# EAGLE design TempStanchion.v3 (EAGLE 7.5.0)
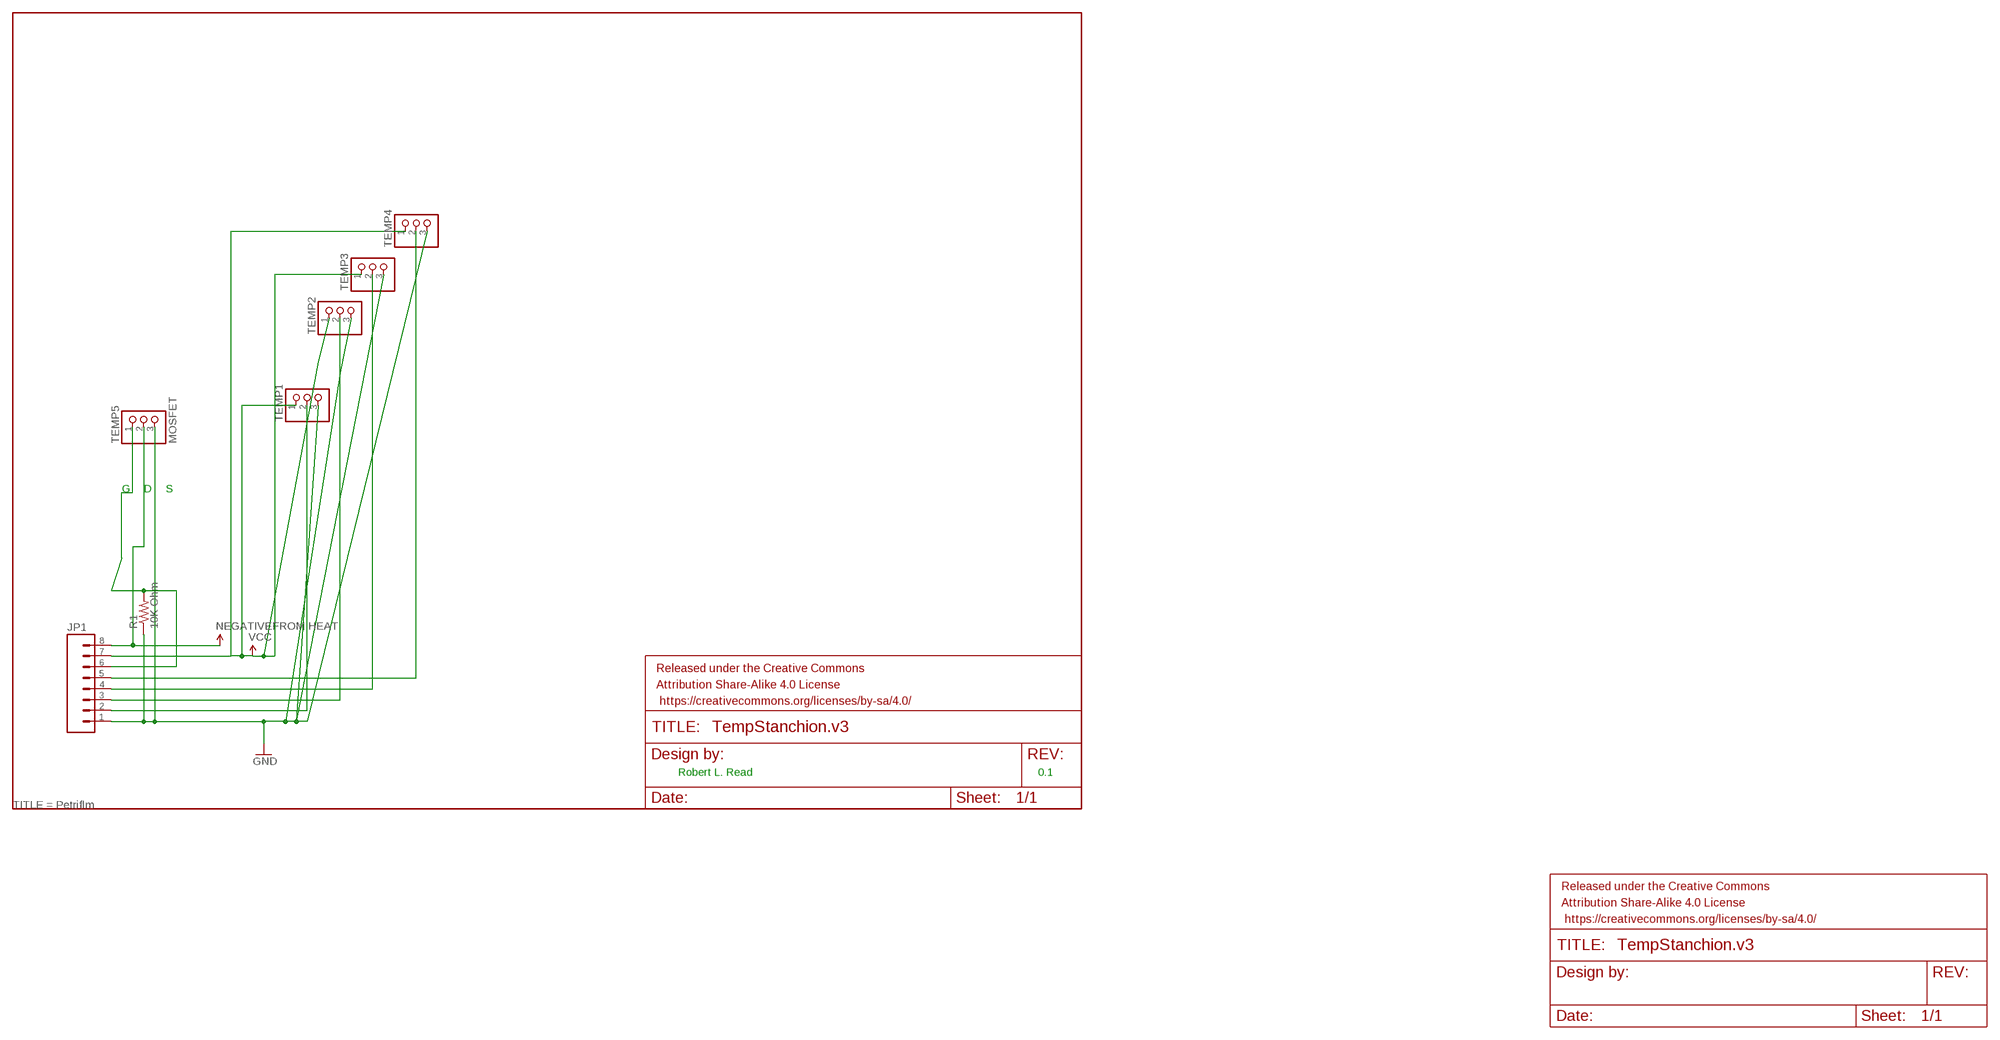
[diagram p0: schematic, sheet 1]

## Parts
FRAME1  FRAME-LETTER  [CREATIVE_COMMONS]
FRAME2  FRAME-LETTER  [CREATIVE_COMMONS]
JP1  M08  [1X08_ROUND]
R1  10K Ohm  RESISTORPTH-1W  [AXIAL-0.6]
TEMP1  PINHD-1X3  [1X03]
TEMP2  PINHD-1X3  [1X03]
TEMP3  PINHD-1X3  [1X03]
TEMP4  PINHD-1X3  [1X03]
TEMP5  MOSFET  PINHD-1X3  [1X03]

## Nets
GND: JP1.1 R1.P$1 TEMP1.3 TEMP2.3 TEMP3.3 TEMP4.3 TEMP5.3
MOSFET: JP1.6 R1.P$2 TEMP5.1
N$2: JP1.2 TEMP1.2
N$3: JP1.3 TEMP2.2
N$4: JP1.4 TEMP3.2
N$5: JP1.5 TEMP4.2
VCC: JP1.7 JP1.8 TEMP1.1 TEMP2.1 TEMP3.1 TEMP4.1 TEMP5.2 ; supply symbol labelled NEGATIVEFROM HEAT

## Notes on the sheet
- G | D | S
- Robert L. Read | 0.1

## Library data of the parts
FRAME1 = SparkFun-Aesthetics:FRAME-LETTER: Schematic Frame Standard 8.5x11 US Letter frame
FRAME2 = SparkFun-Aesthetics:FRAME-LETTER: Schematic Frame Standard 8.5x11 US Letter frame; TITLE: Petriflm
JP1 = SparkFun-Connectors:M08: Header 8 Standard 8-pin 0.1" header. Use with straight break away headers (SKU : PRT-00116), right angle break away headers (PRT-00553), swiss pins (PRT-00743), machine pins (PRT-00117), and female headers (PRT-00115).
R1 = SparkFun-Resistors:RESISTOR: Resistor Basic schematic elements and footprints for 0603, 1206, and PTH resistors.
TEMP1-TEMP5 = adafruit:PINHD-1X3: PIN HEADER

## Net classes
0 default: width 0.305 mm, drill 0.508 mm, clearance 0.381 mm
1 Power: width 0.508 mm, drill 0.508 mm, clearance 0.381 mm

## Board
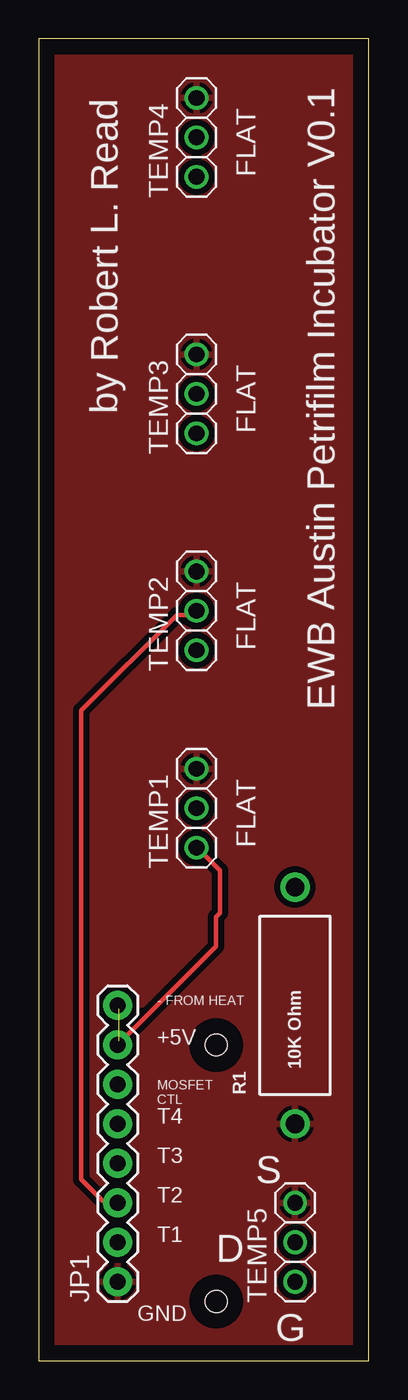
[diagram p1: board, top side]
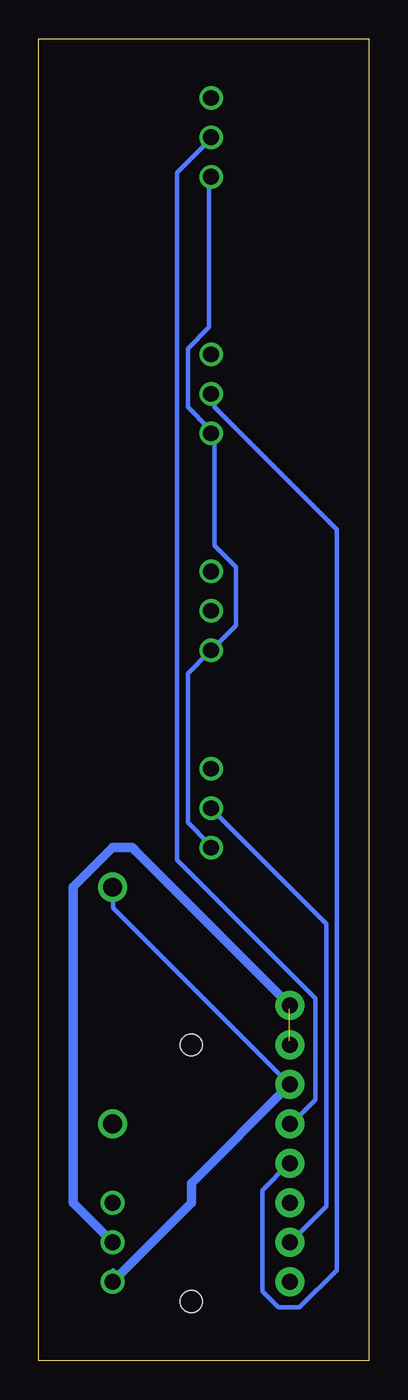
[diagram p2: board, bottom side, seen from below]

Size 21.26 x 85.08 mm. Coordinates in mm from the lower left corner, seen from the top.
Outline: 0,0 21.26,0 21.26,85.08 0,85.08 0,0
Copper layers (1*16): Top 0.035mm / dielectric 1.5mm / Bottom 0.035mm
Design rules "default": minimum track width 10mil, minimum drill 24mil, track to track 8mil, track to pad 8mil, pad to pad 8mil, via to via 8mil, smd to smd 8mil, copper to edge 40mil, drill to drill 8mil, minimum pad ring 10mil, minimum via ring 8mil, stop-mask expansion 4mil, vias tented up to drill 0mil, thermal gap 10mil
Holes 1.4 mm at 11.43,3.81 11.43,20.32

### Footprints (pad centres in the part's own frame; a part is rotated, then mirrored left to right if it is on the bottom)
1X08_ROUND = drill 1.016 pad 1.88: 1 0,0; 2 2.54,0; 3 5.08,0; 4 7.62,0; 5 10.16,0; 6 12.7,0; 7 15.24,0; 8 17.78,0
AXIAL-0.6 = drill 1.2 pad 1.88: P$1 -7.62,0; P$2 7.62,0
1X03 = drill 1.016: 1 -2.54,0; 2 0,0; 3 2.54,0

### Placement (x,y rotation side)
FRAME1  10.16,-31.75 0 top  (outside the outline)
FRAME2  10.16,-40.64 0 top  (outside the outline)
JP1  5.08,5.08 90 top
R1  16.51,22.86 90 top
TEMP1  10.16,35.56 90 top
TEMP2  10.16,48.26 90 top
TEMP3  10.16,62.23 90 top
TEMP4  10.16,78.74 90 top
TEMP5  16.51,7.62 90 top

### Tracks (layer width: path | path; a pad name or v marks a point on that pad's centre or on a via)
GND
  pour Top: 0,86.36 0,-1.27 22.86,-1.27 22.86,86.36
MOSFET
  Bottom 0.305: 16.46,5.83 16.46,5.14 TEMP5.1 | R1.P$2 16.46,30.18 16.46,29.15 5.14,17.83 JP1.6
  Bottom 0.61: 5.14,17.83 5.14,17.72 11.43,11.43 11.43,10.16 TEMP5.1
N$2
  Bottom 0.305: TEMP1.2 9.94,35.32 2.74,28.12 2.74,9.94 4.8,7.89 JP1.2
N$3
  Top 0.305: TEMP2.2 9.94,48.01 8.91,48.01 2.74,41.83 2.74,11.66 4.12,10.29 4.8,10.29 JP1.3
N$4
  Bottom 0.305: TEMP3.2 9.94,62.06 9.94,61.38 2.06,53.49 2.06,5.83 4.46,3.43 5.83,3.43 6.86,4.46 6.86,10.97 5.14,12.69 JP1.4
N$5
  Bottom 0.305: TEMP4.2 10.29,78.52 12.34,76.47 12.34,32.23 3.43,23.32 3.43,16.8 4.8,15.43 JP1.5
VCC  (1 unrouted)
  Top 0.305: JP1.7 5.14,20.57 5.33,20.57 11.43,26.67 11.43,28.57 11.66,28.8 11.66,31.55 10.63,32.58 10.29,32.58 9.94,32.92 TEMP1.1 | 5.14,22.63 JP1.8 5.14,22.97
  Bottom 0.305: 16.8,7.89 TEMP5.2 | TEMP1.1 10.29,33.26 11.66,34.63 11.66,44.23 10.29,45.61 TEMP2.1 9.94,45.95 8.57,47.32 8.57,51.09 9.94,52.46 9.94,59.66 TEMP3.1 10.29,60.01 11.66,61.38 11.66,65.15 10.29,66.52 10.29,76.12 TEMP4.1 | 15.09,32.92 15.24,33.02 | 5.14,22.97 JP1.8
  Bottom 0.61: 16.8,7.89 16.8,7.91 19.05,10.16 19.05,30.48 16.51,33.02 15.24,33.02 | 15.09,32.92 15.09,32.87 JP1.8

### Text on the board
tNames: FLAT | by Robert L. Read | FLAT | FLAT | EWB Austin Petrifilm Incubator V0.1 | FLAT | - FROM HEAT | +5V | MOSFET / CTL | T4 | T3 | S | T2 | T1 | D | GND | G